# Altium schematic sheet Power Supplies.SchDoc: Ravage - Power Supplies
size A4; Address1: Drawn By:; Address2: Dan Visser; DocumentNumber: A; Revision: 0.1-alpha; SheetNumber: 2; SheetTotal: 16; PageSetup: Record=PageOptions|CenterHorizontal=True|CenterVertical=True|PrintScale=0.97|XCorrection=1.00|YCorrection=1.00|PrintKind=1|BorderSize=5000000|LeftOffset=0|BottomOffset=0|Orientation=2|PaperLength=1000|PaperWidth=1000|Scale=100|PaperSource=1274|PrintQuality=600|MediaType=1|DitherType=10|PaperKind=A4|PrintScaleMode=1
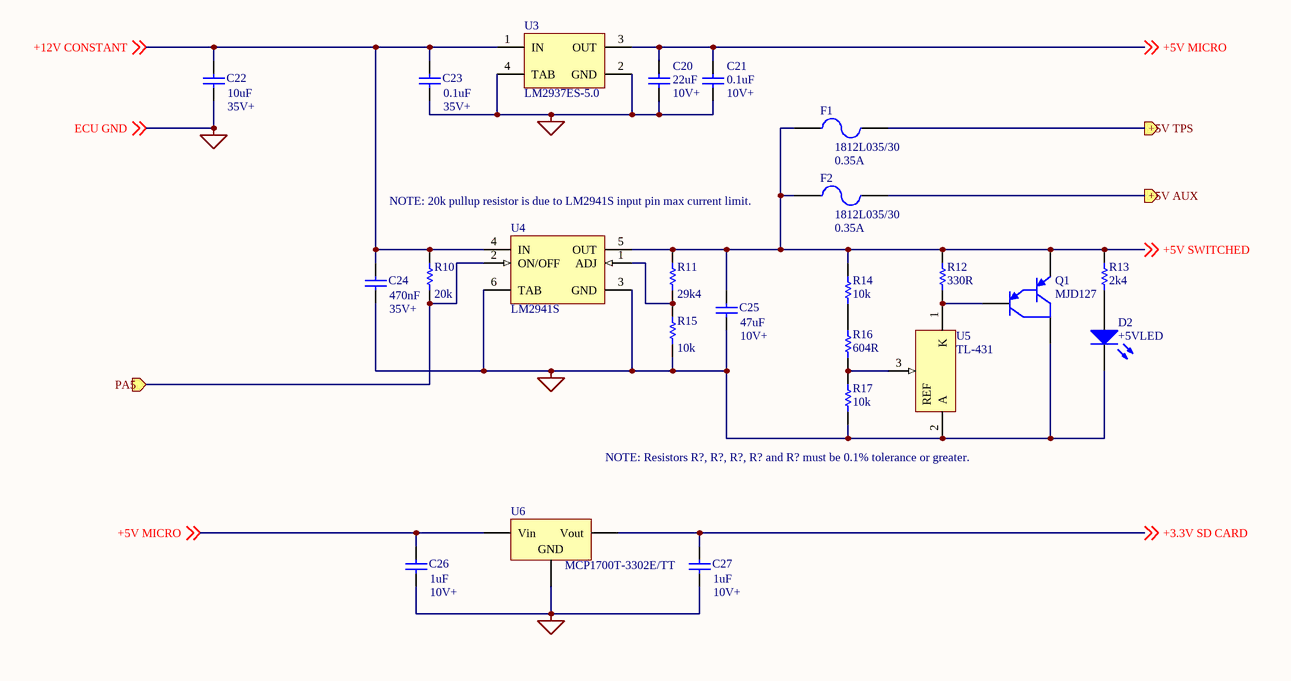
[diagram p0: Power Supplies.SchDoc]

## Parts
C20  value 22uF  [RAD-0.3]
C21  value 0.1uF  [RAD-0.3]
C22  value 10uF  [RAD-0.3]
C23  value 0.1uF  [RAD-0.3]
C24  value 470nF  [RAD-0.3]
C25  value 47uF  [RAD-0.3]
C26  value 1uF  [RAD-0.3]
C27  value 1uF  [RAD-0.3]
D2  +5VLED  [LED-0]
F1  1812L035/30  [PIN-W2/E2.8]
F2  1812L035/30  [PIN-W2/E2.8]
Q1  MJD127  [E3]
R10  value 20k  [AXIAL-0.3]
R11  value 29k4  [AXIAL-0.3]
R12  value 330R  [AXIAL-0.3]
R13  value 2k4  [AXIAL-0.3]
R14  value 10k  [AXIAL-0.3]
R15  value 10k  [AXIAL-0.3]
R16  value 604R  [AXIAL-0.3]
R17  value 10k  [AXIAL-0.3]
U3  LM2937ES-5.0  [TS3B_N]
U4  LM2941S  [TS5B_N]
U5  TL-431
U6  MCP1700T-3302E/TT  [SOT-23-NB3_M]

## Ports
+5V AUX (out), +5V TPS (out), PA5 (in)

## Nets
ECU GND: C20.1 C21.1 C22.1 C23.1 C24.1 C25.1 C26.1 C27.1 D2.2(K) Q1.3(C) R15.1 R17.1 U3.2(GND) U3.4(TAB) U4.3(GND) U4.6(TAB) U5.2(A) U6.1 ; off-sheet ECU GND
+3.3V SD CARD: C27.2 U6.2(Vout) ; off-sheet +3.3V SD CARD
+5V AUX: F2.2 ; port +5V AUX
+5V MICRO: C20.2 C21.2 C26.2 U3.3(OUT) U6.3(Vin) ; off-sheet +5V MICRO
+5V SWITCHED: C25.2 F1.1 F2.1 Q1.1(E) R11.2 R12.2 R13.2 R14.2 U4.5(OUT) ; off-sheet +5V SWITCHED
+5V TPS: F1.2 ; port +5V TPS
+12V CONSTANT: C22.2 C23.2 C24.2 R10.2 U3.1(IN) U4.4(IN) ; off-sheet +12V CONSTANT
PA5: R10.1 U4.2(ON/OFF) ; port PA5
NetD2_1: D2.1(A) R13.1
NetQ1_2: Q1.2(B) R12.1 U5.1(K)
NetR11_1: R11.1 R15.2 U4.1(ADJ)
NetR14_1: R14.1 R16.2
NetR16_1: R16.1 R17.2 U5.3(REF)

## Notes on the sheet
- 10V+
- (near C21) 10V+
- (near C22) 35V+
- (near C23) 35V+
- 0.35A
- (near F2) NOTE: 20k pullup resistor is due to LM2941S input pin max current limit.
- 35V+
- (near C25) 10V+
- NOTE: Resistors R?, R?, R?, R? and R? must be 0.1% tolerance or greater.
- (near C26) 10V+
- (near C27) 10V+
- Title
- Size:
- Date:
- A4
- Number:
- Time:
- Revision:
- Sheet
- of
- (in symbol Volt Reg) GND

## Library data of the parts
C20-C27 = Cap: Capacitor; Published: 8-Jun-2000; LatestRevisionDate: 17-Jul-2002; LatestRevisionNote: Re-released for DXP Platform.; PackageReference: RAD-0.3; Publisher: Altium Limited; PackageDescription: Radial Cap, Thru-Hole; 2 Leads; 0.3 in Pin Spacing
D2 = LED0: Typical INFRARED GaAs LED; Published: 8-Jun-2000; LatestRevisionDate: 08-Jul-2005; LatestRevisionNote: Mech Layer 1 removed.; PackageReference: LED-0; Publisher: Altium Limited; PackageDescription: LED; 2 Leads
F1 F2 = Fuse 2: Fuse; Published: 8-Jun-2000; LatestRevisionDate: 17-Jul-2002; LatestRevisionNote: Re-released for DXP Platform.; PackageReference: PIN-W2/E2.8; Publisher: Altium Limited; PackageDescription: Thru-Hole; 2 Leads
Q1 = PNP1: PNP Darlington Bipolar Transistor; Published: 8-Jun-2000; LatestRevisionDate: 17-Jul-2002; LatestRevisionNote: Re-released for DXP Platform.; DatasheetVersion: May-1994; PackageVersion: 1995/1996; PackageReference: E3; Publisher: Altium Limited; PackageDescription: TO, Flat Index; 3 In-Line, Axial Leads; Body Dia. 4.6mm; Lead Dia. 0.5 mm (max); ComponentLink1Description: Manufacturer Link; ComponentLink1URL: http://www.zetex.com/
R10-R17 = Res1: Resistor; Published: 8-Jun-2000; LatestRevisionDate: 17-Jul-2002; LatestRevisionNote: Re-released for DXP Platform.; PackageReference: AXIAL-0.3; Publisher: Altium Limited; PackageDescription: Axial Device, Thru-Hole; 2 Leads; 0.3 in Pin Spacing
U3 = LM2937ES-5.0: 500 mA Low Dropout Regulator, 3-pin TO-263; Manufacturer: National Semiconductor; PackageTopMarking: NSUZXYTTE#*LM2937ES*-5.0; PowerWise: N; CompType: LDO IC; Published: 4-Dec-2008; DatasheetVersion: Aug-2005; PackageVersion: revF, Apr-2005; PackageReference: TS3B; Publisher: Altium Limited; PackageDescription: TO-263, Molded, .400 x .390 x .180in, 3 Lead, .1in Pitch, Surface Mount; PartNumber: LM2937ES-5.0; RoHS: N; PinCount: 3; Code_JEDEC: MO-169-AA; ComponentLink1Description: LM2937 Datasheet; ComponentLink1URL: http://www.national.com/ds/LM/LM2937.pdf; ComponentLink2Description: LM2937 Web Page; ComponentLink2URL: http://www.national.com/pf/LM/LM2937.html; ComponentLink3Description: TS3B Package Page; ComponentLink3URL: http://www.national.com/packaging/folders/ts3b.html
U4 = LM2941S: 1A Low Dropout Adjustable Regulator, 5-pin TO-263; Manufacturer: National Semiconductor; PackageTopMarking: NSUZXYTTE#*LM2941S*P+; PowerWise: N; CompType: LDO IC; Published: 4-Dec-2008; DatasheetVersion: Nov-2007; PackageVersion: revD, Apr-2005; PackageReference: TS5B; Publisher: Altium Limited; PackageDescription: TO-263, Molded, .400 x .390 x .180in, 5 Lead, .067in Pitch, Surface Mount; Supplier 1: Farnell; Supplier Part Number 1: 9494456; PartNumber: LM2941S; RoHS: N; PinCount: 5; Code_JEDEC: MO-169-AB; ComponentLink1Description: LM2941 Datasheet; ComponentLink1URL: http://www.national.com/ds/LM/LM2941.pdf; ComponentLink2Description: LM2941 Web Page; ComponentLink2URL: http://www.national.com/pf/LM/LM2941.html; ComponentLink3Description: TS5B Package Page; ComponentLink3URL: http://www.national.com/packaging/folders/ts5b.html
U5 = PM-REF-431-SIL3
U6 = Volt Reg: Voltage Regulator; Published: 24-Mar-1999; LatestRevisionDate: 29-May-2009; LatestRevisionNote: IPC-7351 Footprint Added.; PackageReference: D2PAK; Publisher: Altium Limited; PackageDescription: 3-Pin Transistor Outline Package 2.54 mm Pitch, 15.1 mm Lead Span